# Altium schematic sheet terminalstrip.SchDoc
size A
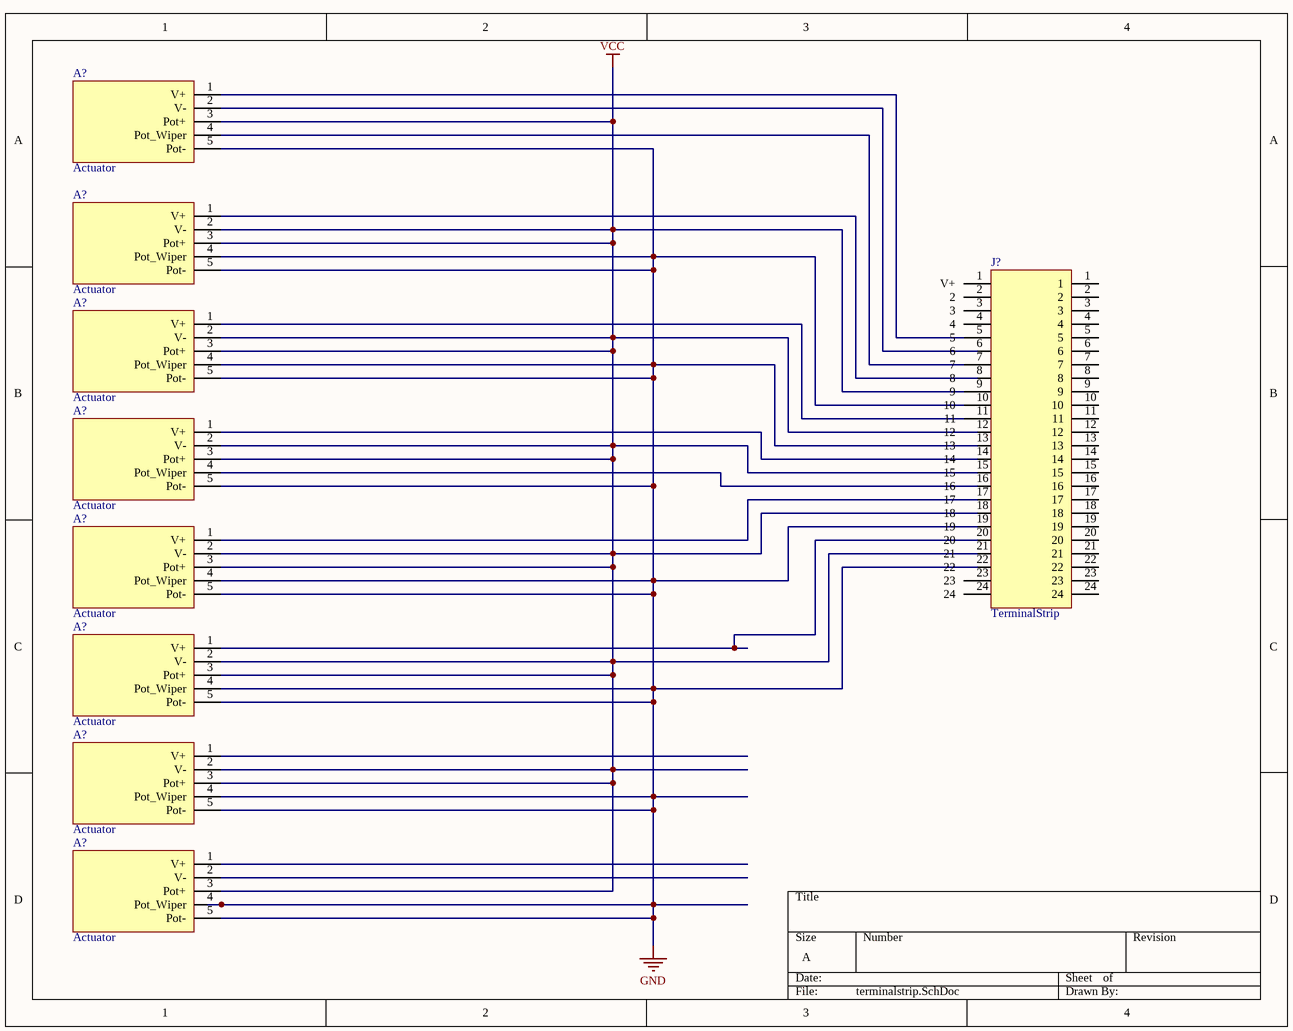
[diagram p0: terminalstrip.SchDoc]

## Parts
(Parts that share a designator on the sheet are numbered #1, #2 ... from top to bottom, then left to right.)
A?#1  Actuator
A?#2  Actuator
A?#3  Actuator
A?#4  Actuator
A?#5  Actuator
A?#6  Actuator
A?#7  Actuator
A?#8  Actuator
J?  TerminalStrip

## Nets
GND: A?#1.5(Pot-) A?#2.4(Pot_Wiper) A?#2.5(Pot-) A?#3.4(Pot_Wiper) A?#3.5(Pot-) A?#4.5(Pot-) A?#5.4(Pot_Wiper) A?#5.5(Pot-) A?#6.4(Pot_Wiper) A?#6.5(Pot-) A?#7.4(Pot_Wiper) A?#7.5(Pot-) A?#8.4(Pot_Wiper) A?#8.5(Pot-)
VCC: A?#1.3(Pot+) A?#2.2(V-) A?#2.3(Pot+) A?#3.2(V-) A?#3.3(Pot+) A?#4.2(V-) A?#4.3(Pot+) A?#5.2(V-) A?#5.3(Pot+) A?#6.2(V-) A?#6.3(Pot+) A?#7.2(V-) A?#7.3(Pot+) A?#8.3(Pot+)

Not connected (* = marked no-connect by the designer): A?#1 1(V+) 2(V-) 4(Pot_Wiper); A?#2 1(V+); A?#3 1(V+); A?#4 1(V+) 4(Pot_Wiper); A?#5 1(V+); A?#6 1(V+); A?#7 1(V+); A?#8 1(V+) 2(V-); J? 1(V+) 2 3 4 5 6 7 8 9 10 11 12 13 14 15 16 17 18 19 20 21 22 23 24